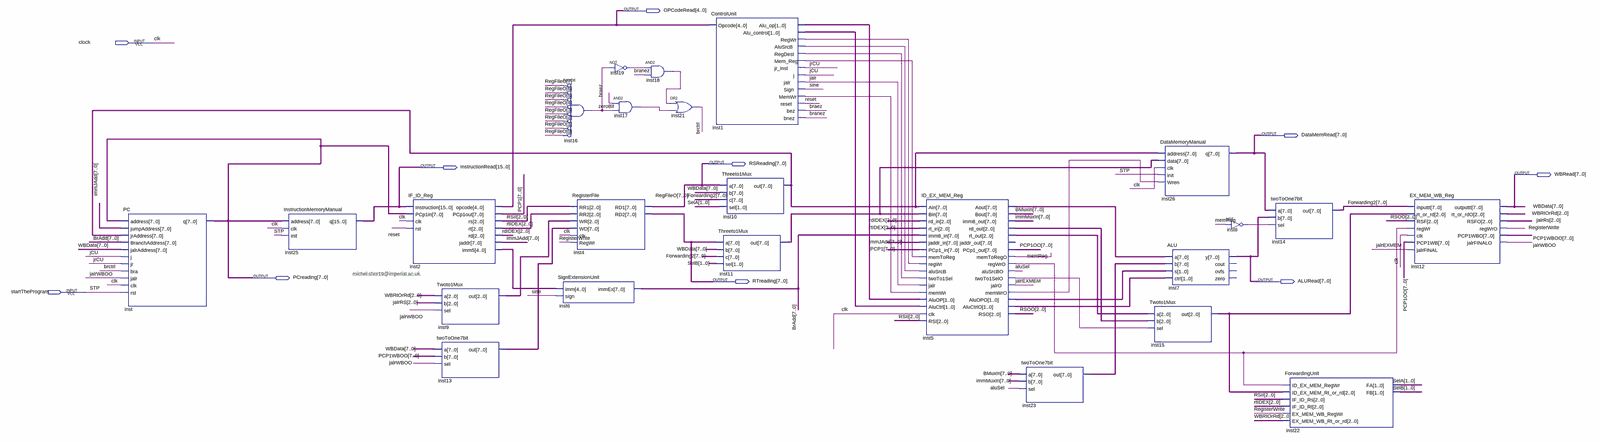
[diagram p0: schematic sheet, whole]
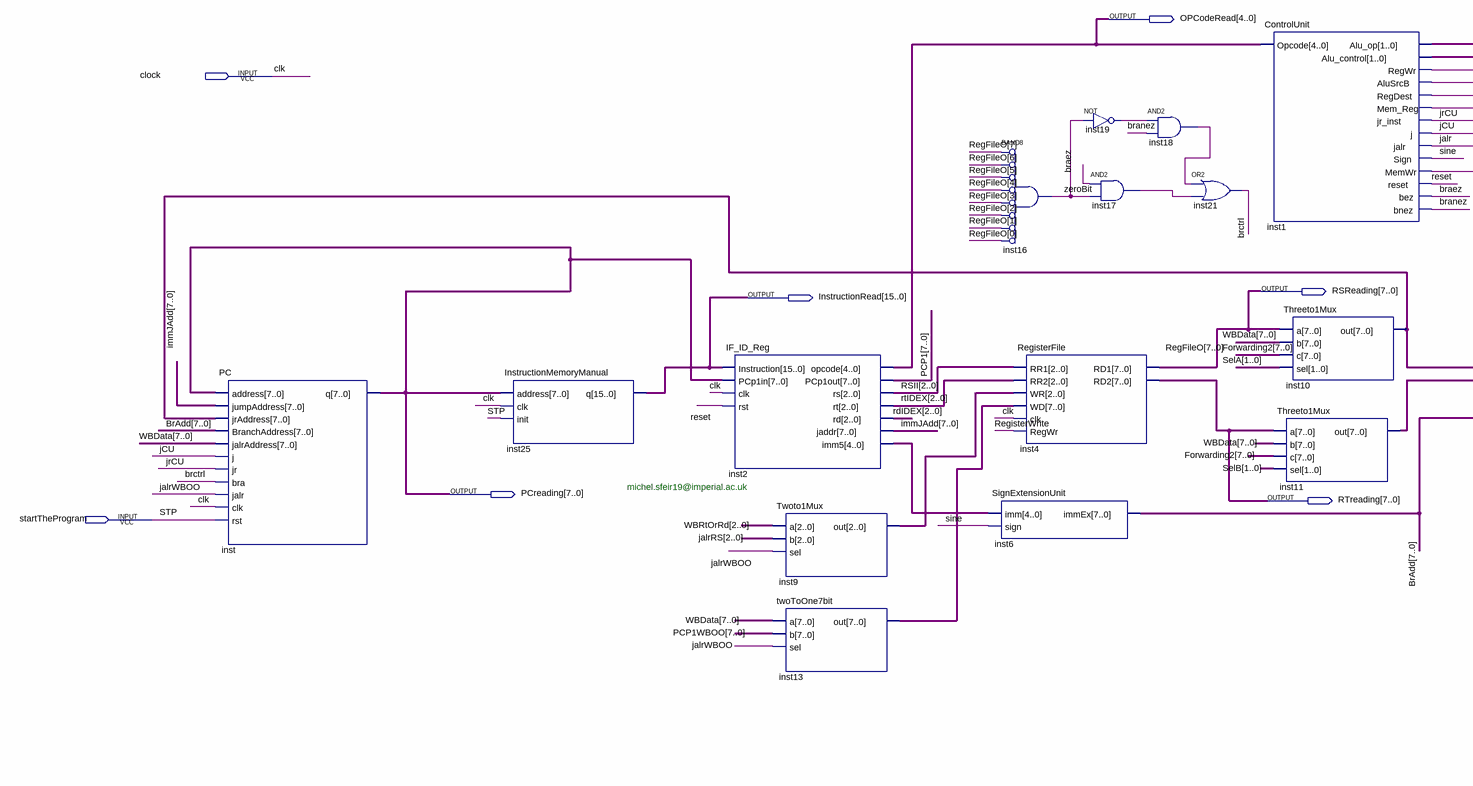
[diagram p1: schematic sheet, left part]
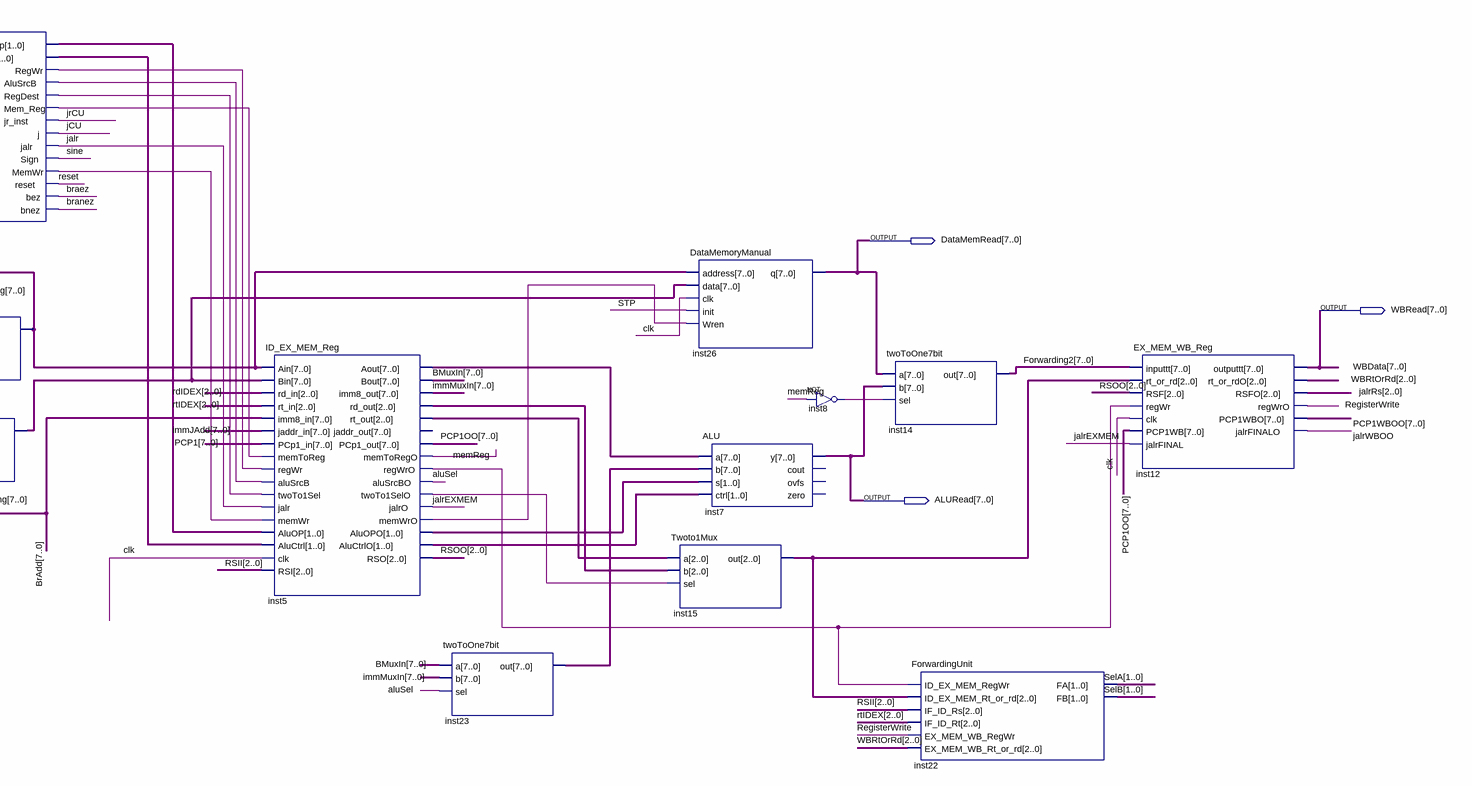
[diagram p2: schematic sheet, right part]
// Quartus schematic Main.bdf as structural Verilog: 24 symbols, 10 pins
module Main (
  input  clock,
  input  startTheProgram,
  output [4:0] OPCodeRead,
  output [7:0] DataMemRead,
  output [7:0] RSReading,
  output [15:0] InstructionRead,
  output [7:0] WBRead,
  output [7:0] PCreading,
  output [7:0] RTreading,
  output [7:0] ALURead
);

  wire aluSel, braez, branez, brctrl, inst1_alusrcb, inst1_mem_reg, inst1_memwr, inst1_regdest, inst1_regwr,
       inst5_memwro, inst5_regwro, inst5_twoto1selo, inst8_out, inst17_out, inst18_out, inst19_out, jalr,
       jalrEXMEM, jalrWBOO, jCU, jrCU, memReg, RegisterWrite, reset, sine, zeroBit;
  wire [1:0] inst1_alu_control, inst1_alu_op, inst5_aluctrlo, inst5_aluopo, SelA, SelB;
  wire [2:0] inst5_rd_out, inst5_rt_out, inst9_out, inst15_out, jalrRS, rdIDEX, RSII, RSOO, rtIDEX, WBRtOrRd;
  wire [4:0] inst2_imm5;
  wire [7:0] BMuxIn, BrAdd, Forwarding2, immJAdd, immMuxIn, inst5_aout, inst10_out, inst11_out, inst13_out,
       inst23_out, PCP1, PCP1OO, PCP1WBOO;

  PC inst (
    .address(PCreading), .jumpAddress(immJAdd), .jrAddress(inst10_out), .BranchAddress(BrAdd),
    .jalrAddress(WBRead), .j(jCU), .jr(jrCU), .bra(brctrl), .jalr(jalrWBOO), .clk(clock),
    .rst(startTheProgram), .q(PCreading));
  InstructionMemoryManual inst25 (.address(PCreading), .clk(clock), .init(startTheProgram), .q(InstructionRead));
  IF_ID_Reg inst2 (
    .Instruction(InstructionRead), .PCp1in(PCreading), .clk(clock), .rst(reset), .opcode(OPCodeRead),
    .PCp1out(PCP1), .rs(RSII), .rt(rtIDEX), .rd(rdIDEX), .jaddr(immJAdd), .imm5(inst2_imm5));
  Twoto1Mux inst9 (.a(WBRtOrRd), .b(jalrRS), .sel(jalrWBOO), .out(inst9_out));
  twoToOne7bit inst13 (.a(WBRead), .b(PCP1WBOO), .sel(jalrWBOO), .out(inst13_out));
  SignExtensionUnit inst6 (.imm(inst2_imm5), .sign(sine), .immEx(BrAdd));
  and inst16 (zeroBit, ~RSReading[7], ~RSReading[6], ~RSReading[5], ~RSReading[4], ~RSReading[3], ~RSReading[2], ~RSReading[1], ~RSReading[0]);  // BAND8
  RegisterFile inst4 (
    .RR1(RSII), .RR2(rtIDEX), .WR(inst9_out), .WD(inst13_out), .clk(clock), .RegWr(RegisterWrite),
    .RD1(RSReading), .RD2(RTreading));
  not inst19 (inst19_out, zeroBit);
  and inst17 (inst17_out, braez, zeroBit);
  and inst18 (inst18_out, inst19_out, branez);
  or inst21 (brctrl, inst18_out, inst17_out);
  ControlUnit inst1 (
    .Opcode(OPCodeRead), .Alu_op(inst1_alu_op), .Alu_control(inst1_alu_control), .RegWr(inst1_regwr),
    .AluSrcB(inst1_alusrcb), .RegDest(inst1_regdest), .Mem_Reg(inst1_mem_reg), .jr_inst(jrCU), .j(jCU),
    .jalr(jalr), .Sign(sine), .MemWr(inst1_memwr), .reset(reset), .bez(braez), .bnez(branez));
  Threeto1Mux inst10 (.a(RSReading), .b(WBRead), .c(Forwarding2), .sel(SelA), .out(inst10_out));
  Threeto1Mux inst11 (.a(RTreading), .b(WBRead), .c(Forwarding2), .sel(SelB), .out(inst11_out));
  ID_EX_MEM_Reg inst5 (
    .Ain(inst10_out), .Bin(inst11_out), .rd_in(rdIDEX), .rt_in(rtIDEX), .imm8_in(BrAdd), .jaddr_in(immJAdd),
    .PCp1_in(PCP1), .memToReg(inst1_mem_reg), .regWr(inst1_regwr), .aluSrcB(inst1_alusrcb),
    .twoTo1Sel(inst1_regdest), .jalr(jalr), .memWr(inst1_memwr), .AluOP(inst1_alu_op),
    .AluCtrl(inst1_alu_control), .clk(clock), .RSI(RSII), .Aout(inst5_aout), .Bout(BMuxIn),
    .imm8_out(immMuxIn), .rd_out(inst5_rd_out), .rt_out(inst5_rt_out), .PCp1_out(PCP1OO), .memToRegO(memReg),
    .regWrO(inst5_regwro), .aluSrcBO(aluSel), .twoTo1SelO(inst5_twoto1selo), .jalrO(jalrEXMEM),
    .memWrO(inst5_memwro), .AluOPO(inst5_aluopo), .AluCtrlO(inst5_aluctrlo), .RSO(RSOO));  // open: jaddr_out
  twoToOne7bit inst23 (.a(BMuxIn), .b(immMuxIn), .sel(aluSel), .out(inst23_out));
  DataMemoryManual inst26 (
    .address(inst10_out), .data(inst11_out), .clk(clock), .init(startTheProgram), .Wren(inst5_memwro),
    .q(DataMemRead));
  Twoto1Mux inst15 (.a(inst5_rt_out), .b(inst5_rd_out), .sel(inst5_twoto1selo), .out(inst15_out));
  ALU inst7 (
    .a(inst5_aout), .b(inst23_out), .s(inst5_aluopo), .ctrl(inst5_aluctrlo), .y(ALURead));  // open: cout, ovfs, zero
  not inst8 (inst8_out, memReg);
  twoToOne7bit inst14 (.a(DataMemRead), .b(ALURead), .sel(inst8_out), .out(Forwarding2));
  ForwardingUnit inst22 (
    .ID_EX_MEM_RegWr(inst5_regwro), .ID_EX_MEM_Rt_or_rd(inst15_out), .IF_ID_Rs(RSII), .IF_ID_Rt(rtIDEX),
    .EX_MEM_WB_RegWr(RegisterWrite), .EX_MEM_WB_Rt_or_rd(WBRtOrRd), .FA(SelA), .FB(SelB));
  EX_MEM_WB_Reg inst12 (
    .inputtt(Forwarding2), .rt_or_rd(inst15_out), .RSF(RSOO), .regWr(inst5_regwro), .clk(clock),
    .PCP1WB(PCP1OO), .jalrFINAL(jalrEXMEM), .outputtt(WBRead), .rt_or_rdO(WBRtOrRd), .RSFO(jalrRS),
    .regWrO(RegisterWrite), .PCP1WBO(PCP1WBOO), .jalrFINALO(jalrWBOO));

  // Other names for the same wires on the sheet: clk = clock; RegFileO[7:0] = RSReading; STP = startTheProgram;
  //   WBData[7:0] = WBRead

  // Notes on the sheet:
  //   michel.sfeir19@imperial.ac.uk
endmodule
